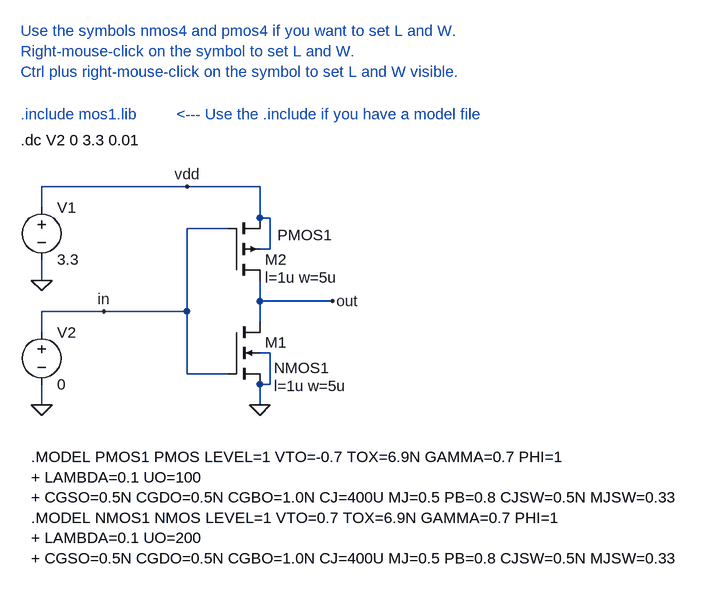
[diagram p0: schematic cmos_inverter1.asc]
cmos_inverter1.asc, the LTspice schematic file:
Version 4
SHEET 1 1036 680
WIRE 144 -64 -80 -64
WIRE 256 -64 144 -64
WIRE -80 -32 -80 -64
WIRE 256 -16 256 -64
WIRE 272 -16 256 -16
WIRE 208 0 144 0
WIRE 272 32 272 -16
WIRE 272 32 256 32
WIRE -80 80 -80 48
WIRE 256 112 256 80
WIRE 368 112 256 112
WIRE 16 128 -80 128
WIRE 144 128 144 0
WIRE 144 128 16 128
WIRE 256 144 256 112
WIRE -80 160 -80 128
WIRE 272 192 256 192
WIRE 144 224 144 128
WIRE 208 224 144 224
WIRE 272 240 272 192
WIRE 272 240 256 240
WIRE -80 272 -80 240
WIRE 256 272 256 240
FLAG -80 80 0
FLAG -80 272 0
FLAG 256 272 0
FLAG 16 128 in
FLAG 368 112 out
FLAG 144 -64 vdd
SYMBOL nmos4 208 144 R0
WINDOW 3 70 71 Left 0
WINDOW 123 70 99 Left 0
SYMATTR InstName M1
SYMATTR Value NMOS1
SYMATTR Value2 l=1u w=5u
SYMBOL pmos4 208 80 M180
WINDOW 3 75 70 Left 0
WINDOW 123 56 4 Left 0
SYMATTR InstName M2
SYMATTR Value PMOS1
SYMATTR Value2 l=1u w=5u
SYMBOL voltage -80 -48 R0
SYMATTR InstName V1
SYMATTR Value 3.3
SYMBOL voltage -80 144 R0
SYMATTR InstName V2
SYMATTR Value 0
TEXT -112 -136 Left 0 !.dc V2 0 3.3 0.01
TEXT -96 352 Left 0 !.MODEL PMOS1 PMOS LEVEL=1 VTO=-0.7 TOX=6.9N GAMMA=0.7 PHI=1\n+ LAMBDA=0.1 UO=100\n+ CGSO=0.5N CGDO=0.5N CGBO=1.0N CJ=400U MJ=0.5 PB=0.8 CJSW=0.5N MJSW=0.33\n.MODEL NMOS1 NMOS LEVEL=1 VTO=0.7 TOX=6.9N GAMMA=0.7 PHI=1\n+ LAMBDA=0.1 UO=200\n+ CGSO=0.5N CGDO=0.5N CGBO=1.0N CJ=400U MJ=0.5 PB=0.8 CJSW=0.5N MJSW=0.33
TEXT -112 -176 Left 0 ;.include mos1.lib
TEXT 128 -176 Left 0 ;<--- Use the .include if you have a model file
TEXT -112 -304 Left 0 ;Use the symbols nmos4 and pmos4 if you want to set L and W.\nRight-mouse-click on the symbol to set L and W.\nCtrl plus right-mouse-click on the symbol to set L and W visible.

The netlist it stands for:
* cmos_inverter1.asc
M1 out in 0 0 NMOS1 l=1u w=5u
M2 out in vdd vdd PMOS1 l=1u w=5u
V1 vdd 0 3.3
V2 in 0 0
.model NMOS NMOS
.model PMOS PMOS
.lib standard.mos
.dc V2 0 3.3 0.01
.MODEL PMOS1 PMOS LEVEL=1 VTO=-0.7 TOX=6.9N GAMMA=0.7 PHI=1
+ LAMBDA=0.1 UO=100
+ CGSO=0.5N CGDO=0.5N CGBO=1.0N CJ=400U MJ=0.5 PB=0.8 CJSW=0.5N MJSW=0.33
.MODEL NMOS1 NMOS LEVEL=1 VTO=0.7 TOX=6.9N GAMMA=0.7 PHI=1
+ LAMBDA=0.1 UO=200
+ CGSO=0.5N CGDO=0.5N CGBO=1.0N CJ=400U MJ=0.5 PB=0.8 CJSW=0.5N MJSW=0.33
* .include mos1.lib
* <--- Use the .include if you have a model file
* Use the symbols nmos4 and pmos4 if you want to set L and W.
* Right-mouse-click on the symbol to set L and W.
* Ctrl plus right-mouse-click on the symbol to set L and W visible.
.backanno
.end